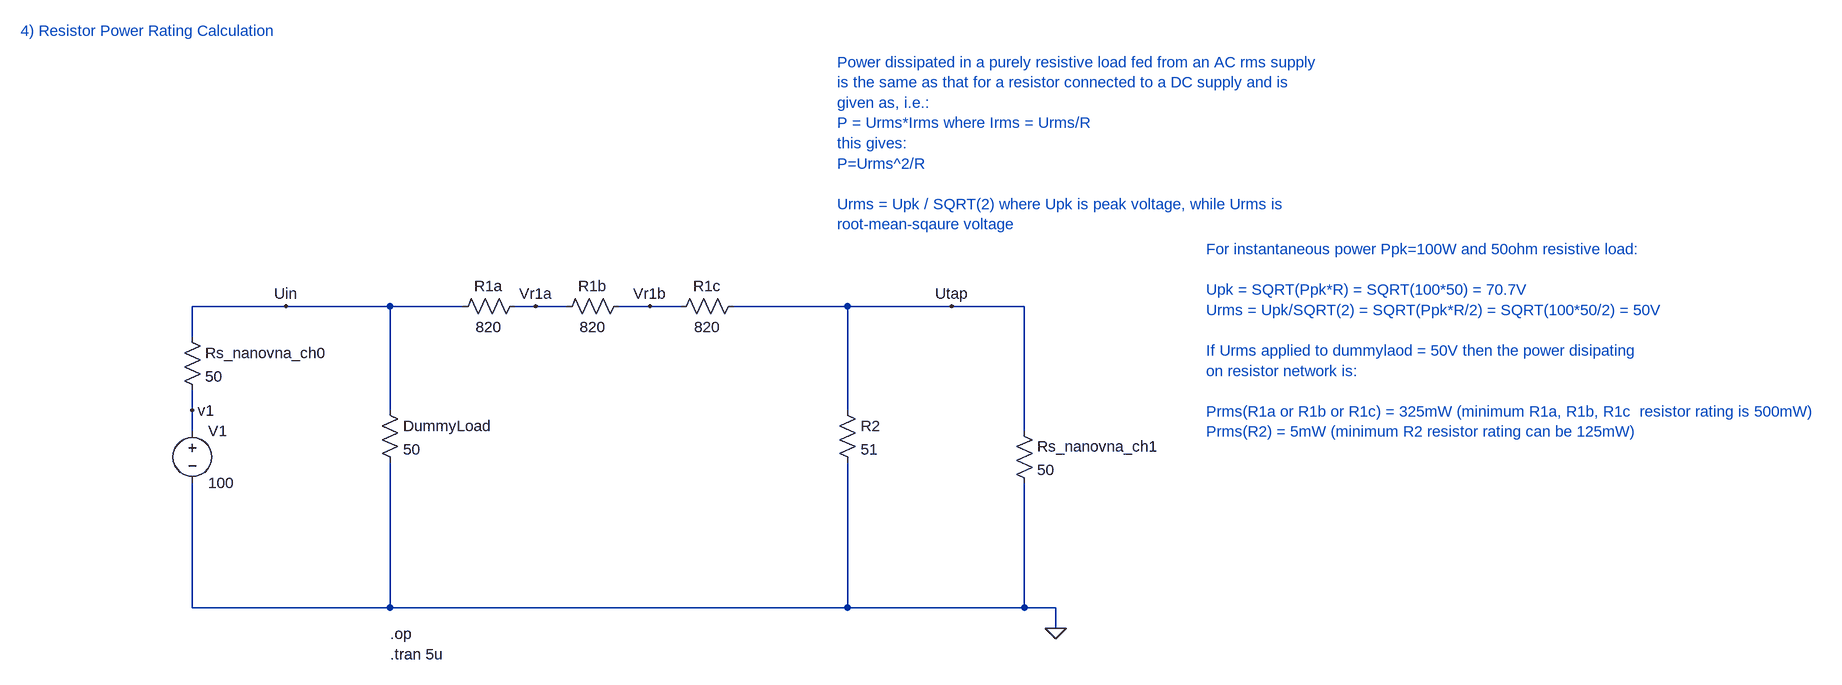
[diagram p0: schematic RFTap_v1_terminated_RF_Path_100W.asc]
RFTap_v1_terminated_RF_Path_100W.asc, the LTspice schematic file:
Version 4
SHEET 1 1764 1784
WIRE -3344 592 -3488 592
WIRE -3184 592 -3344 592
WIRE -3072 592 -3184 592
WIRE -2960 592 -2992 592
WIRE -2912 592 -2960 592
WIRE -2784 592 -2832 592
WIRE -2736 592 -2784 592
WIRE -2480 592 -2656 592
WIRE -2320 592 -2480 592
WIRE -2208 592 -2320 592
WIRE -3488 640 -3488 592
WIRE -3488 752 -3488 720
WIRE -3184 752 -3184 592
WIRE -2480 752 -2480 592
WIRE -3488 784 -3488 752
WIRE -2208 784 -2208 592
WIRE -3488 1056 -3488 864
WIRE -3184 1056 -3184 832
WIRE -3184 1056 -3488 1056
WIRE -2480 1056 -2480 832
WIRE -2480 1056 -3184 1056
WIRE -2208 1056 -2208 864
WIRE -2208 1056 -2480 1056
WIRE -2160 1056 -2208 1056
WIRE -2160 1088 -2160 1056
FLAG -2160 1088 0
FLAG -3488 752 v1
FLAG -3344 592 Uin
FLAG -2320 592 Utap
FLAG -2960 592 Vr1a
FLAG -2784 592 Vr1b
DATAFLAG -3184 592 ""
DATAFLAG -2480 592 ""
SYMBOL res -2224 768 R0
SYMATTR InstName Rs_nanovna_ch1
SYMATTR Value 50
SYMBOL res -3504 624 R0
SYMATTR InstName Rs_nanovna_ch0
SYMATTR Value 50
SYMBOL res -3200 736 R0
SYMATTR InstName DummyLoad
SYMATTR Value 50
SYMBOL res -2496 736 R0
SYMATTR InstName R2
SYMATTR Value 51
SYMBOL res -2976 576 R90
WINDOW 0 0 56 VBottom 2
WINDOW 3 32 56 VTop 2
SYMATTR InstName R1a
SYMATTR Value 820
SYMBOL voltage -3488 768 R0
SYMATTR InstName V1
SYMATTR Value 100
SYMBOL res -2816 576 R90
WINDOW 0 0 56 VBottom 2
WINDOW 3 32 56 VTop 2
SYMATTR InstName R1b
SYMATTR Value 820
SYMBOL res -2640 576 R90
WINDOW 0 0 56 VBottom 2
WINDOW 3 32 56 VTop 2
SYMATTR InstName R1c
SYMATTR Value 820
TEXT -3752 168 Left 2 ;4) Resistor Power Rating Calculation
TEXT -3184 1096 Left 2 !.op
TEXT -2496 216 Left 2 ;Power dissipated in a purely resistive load fed from an AC rms supply \nis the same as that for a resistor connected to a DC supply and is \ngiven as, i.e.:\nP = Urms*Irms where Irms = Urms/R\nthis gives:\nP=Urms^2/R\n \nUrms = Upk / SQRT(2) where Upk is peak voltage, while Urms is \nroot-mean-sqaure voltage
TEXT -3184 1128 Left 2 !.tran 5u
TEXT -1928 504 Left 2 ;For instantaneous power Ppk=100W and 50ohm resistive load:\n \nUpk = SQRT(Ppk*R) = SQRT(100*50) = 70.7V\nUrms = Upk/SQRT(2) = SQRT(Ppk*R/2) = SQRT(100*50/2) = 50V\n \nIf Urms applied to dummylaod = 50V then the power disipating \non resistor network is:\n \nPrms(R1a or R1b or R1c) = 325mW (minimum R1a, R1b, R1c  resistor rating is 500mW)\nPrms(R2) = 5mW (minimum R2 resistor rating can be 125mW)

The netlist it stands for:
* RFTap_v1_terminated_RF_Path_100W.asc
Rs_nanovna_ch1 Utap 0 50
Rs_nanovna_ch0 Uin v1 50
R§DummyLoad Uin 0 50
R2 Utap 0 51
R1a Vr1a Uin 820
V1 v1 0 100
R1b Vr1b Vr1a 820
R1c Utap Vr1b 820
* 4) Resistor Power Rating Calculation
.op
* Power dissipated in a purely resistive load fed from an AC rms supply
* is the same as that for a resistor connected to a DC supply and is
* given as, i.e.:
* P = Urms*Irms where Irms = Urms/R
* this gives:
* P=Urms^2/R
* Urms = Upk / SQRT(2) where Upk is peak voltage, while Urms is
* root-mean-sqaure voltage
.tran 5u
* For instantaneous power Ppk=100W and 50ohm resistive load:
* Upk = SQRT(Ppk*R) = SQRT(100*50) = 70.7V
* Urms = Upk/SQRT(2) = SQRT(Ppk*R/2) = SQRT(100*50/2) = 50V
* If Urms applied to dummylaod = 50V then the power disipating
* on resistor network is:
* Prms(R1a or R1b or R1c) = 325mW (minimum R1a, R1b, R1c  resistor rating is 500mW)
* Prms(R2) = 5mW (minimum R2 resistor rating can be 125mW)
.backanno
.end